# EasyEDA Pro project ProPrj_KrabbyUno - v0.1_2026-05-19.epro, schematic Schematic2

## Sheets
1 P1: Board Name: Schematic2; Create Date: 2026-01-31; Page Name: P1; Project Name: Patina Foundation Grant; Schematic Name: Schematic2; Update Date: 2026-04-19; Company: EasyEDA.com; Page Size: A4; Version: V1.0
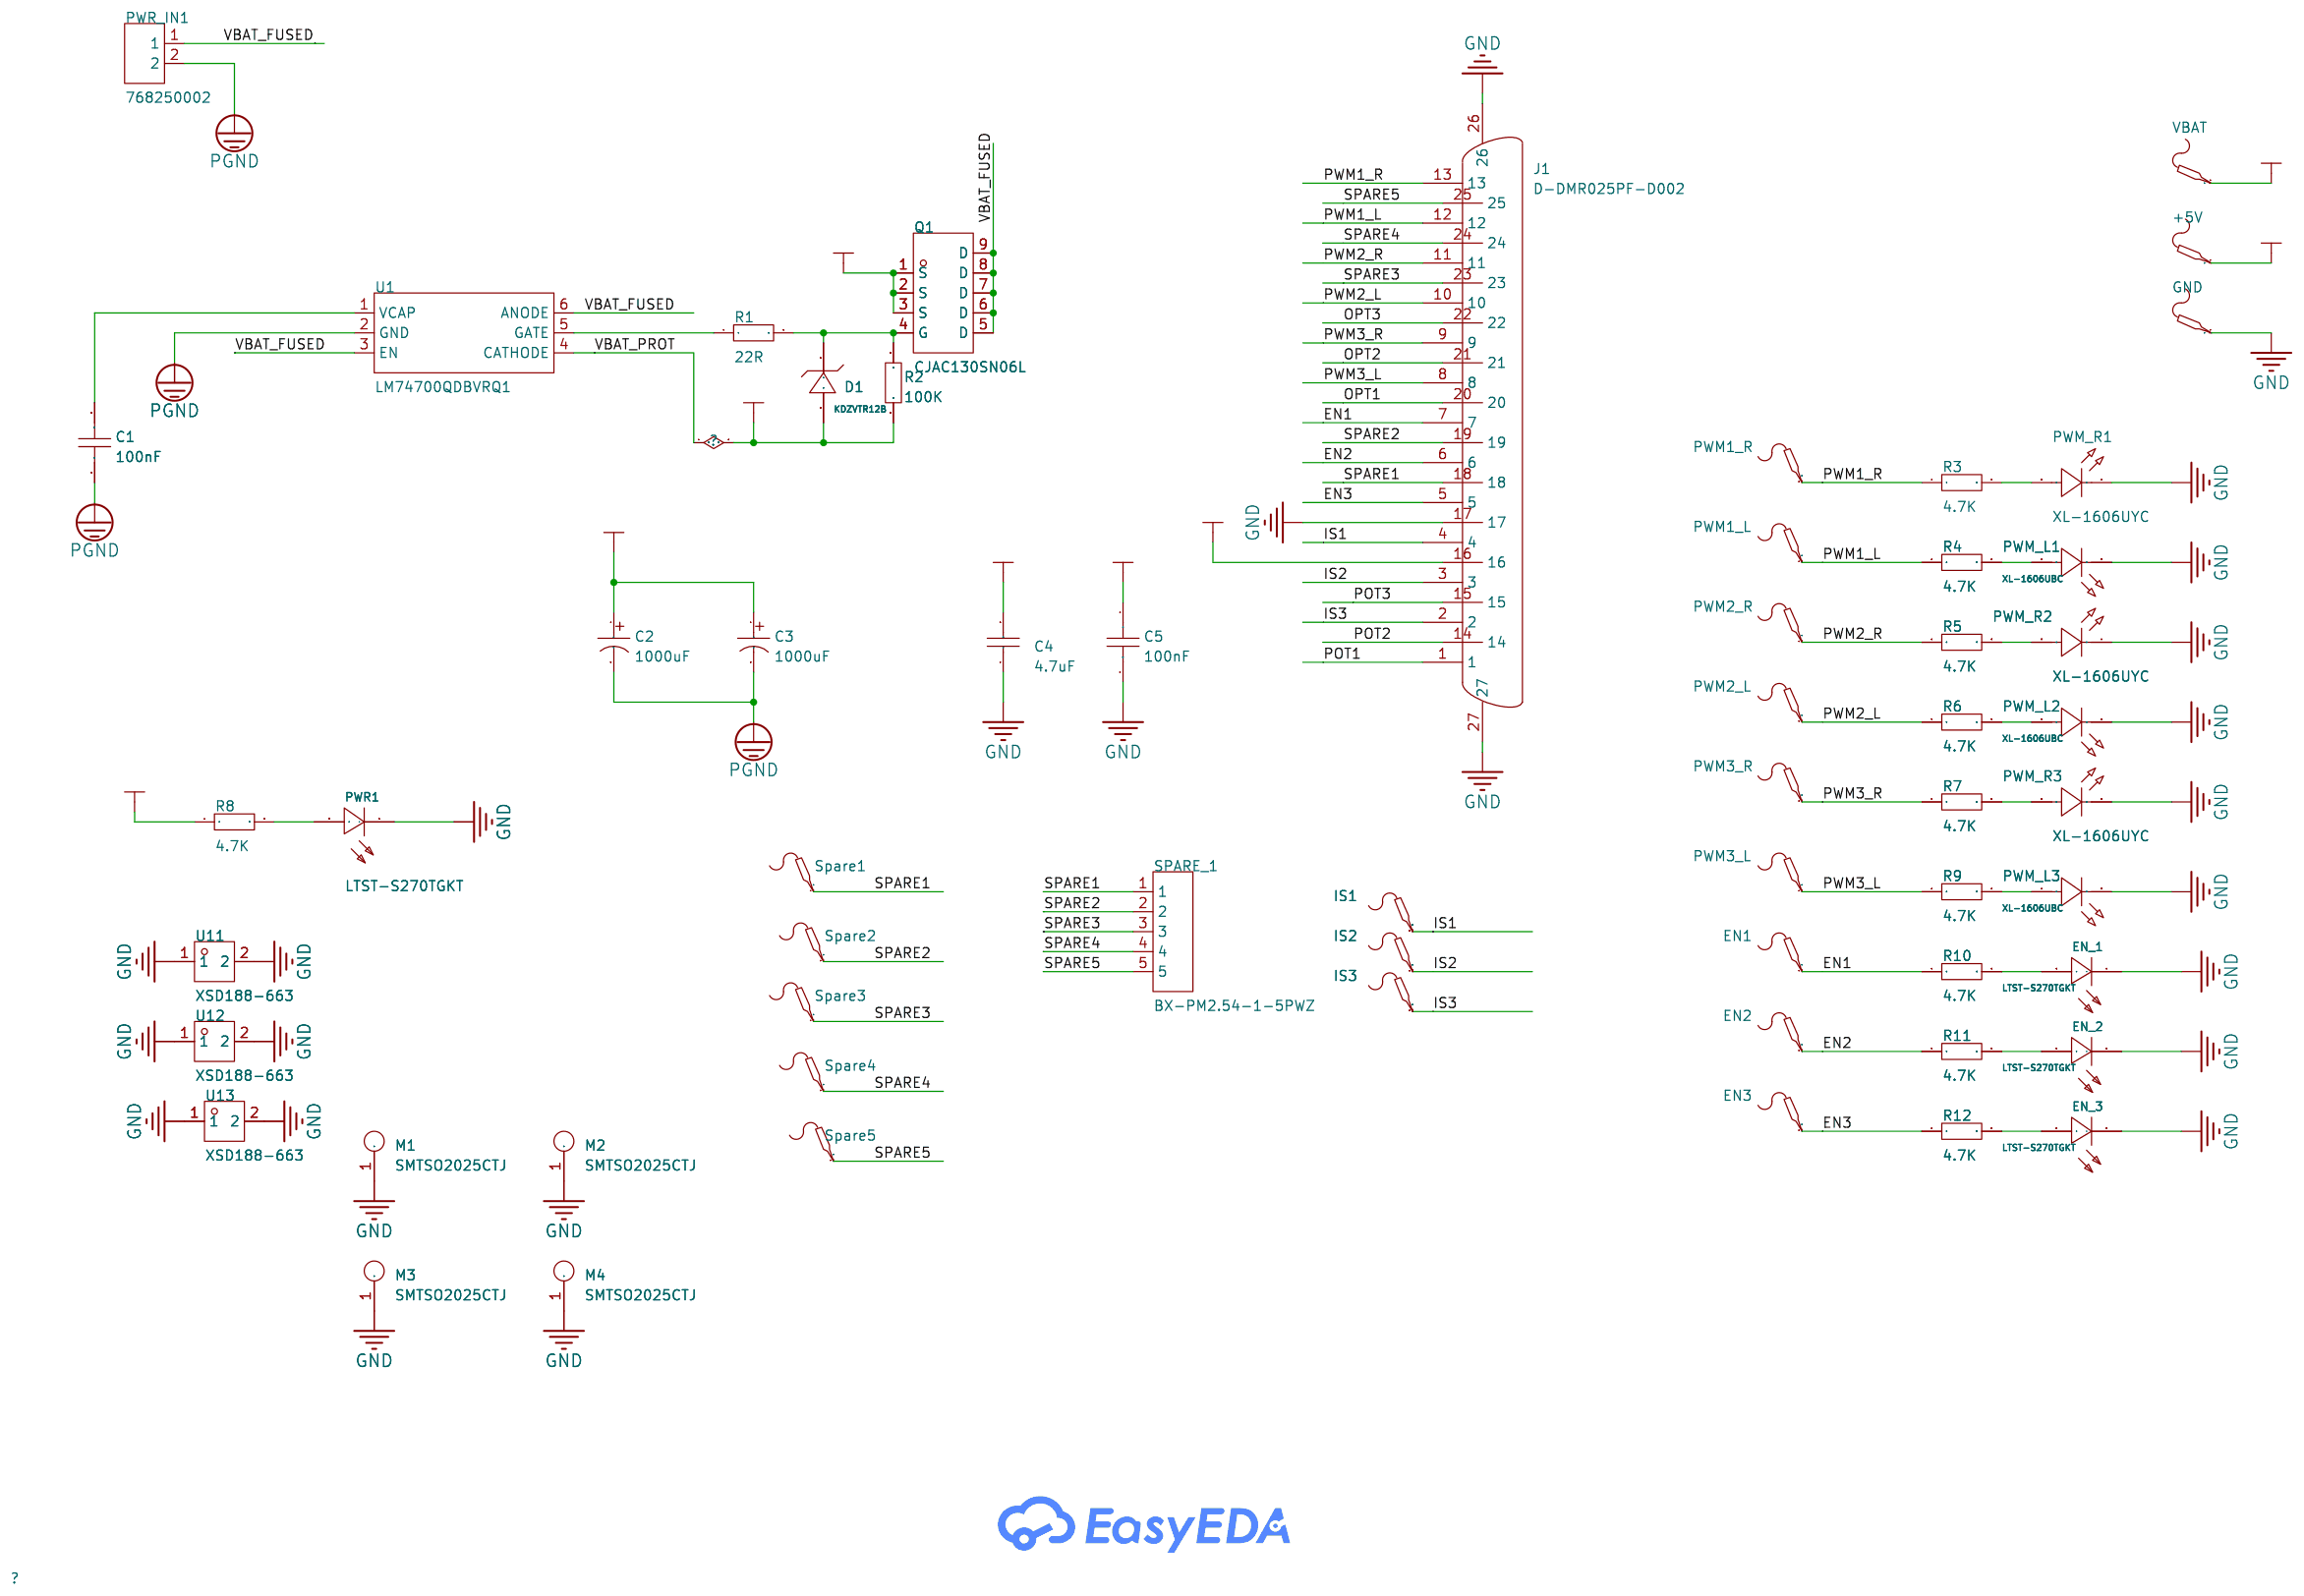
[diagram p2: P1]
2 Motor 1: Create Date: 2026-02-01; Page Name: Motor 1
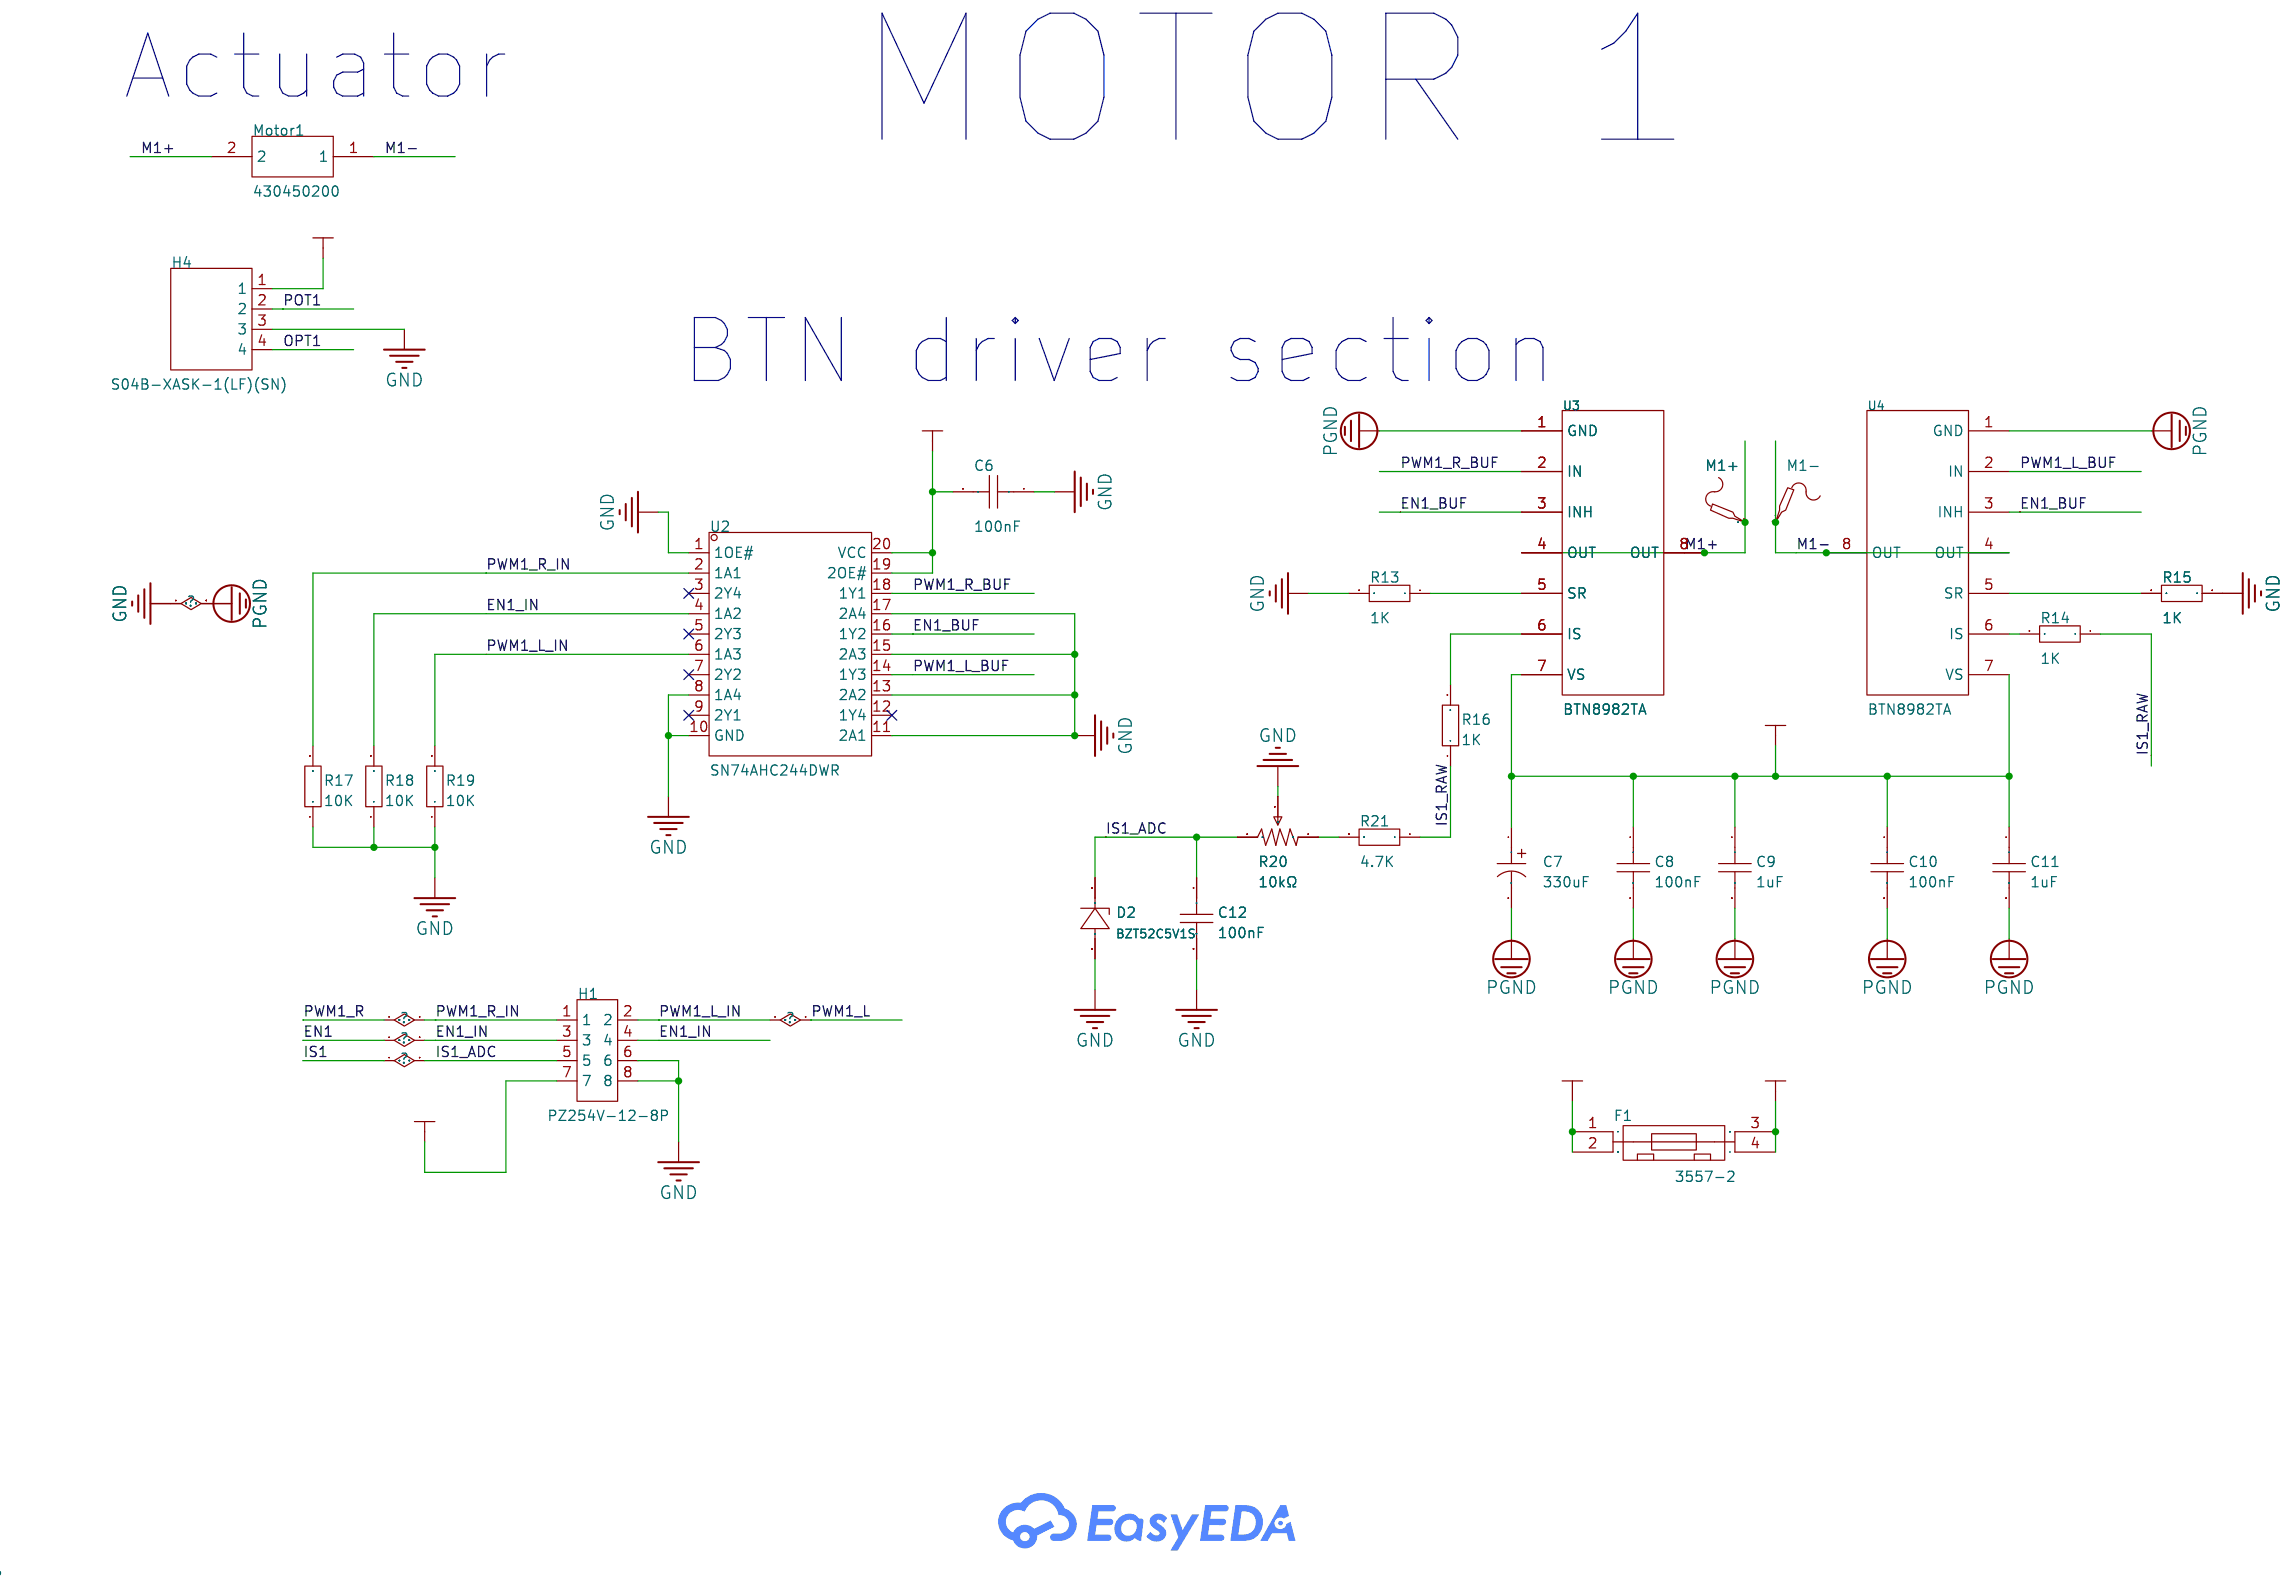
[diagram p3: Motor 1]
3 Motor 2: Create Date: 2026-02-02; Page Name: Motor 2
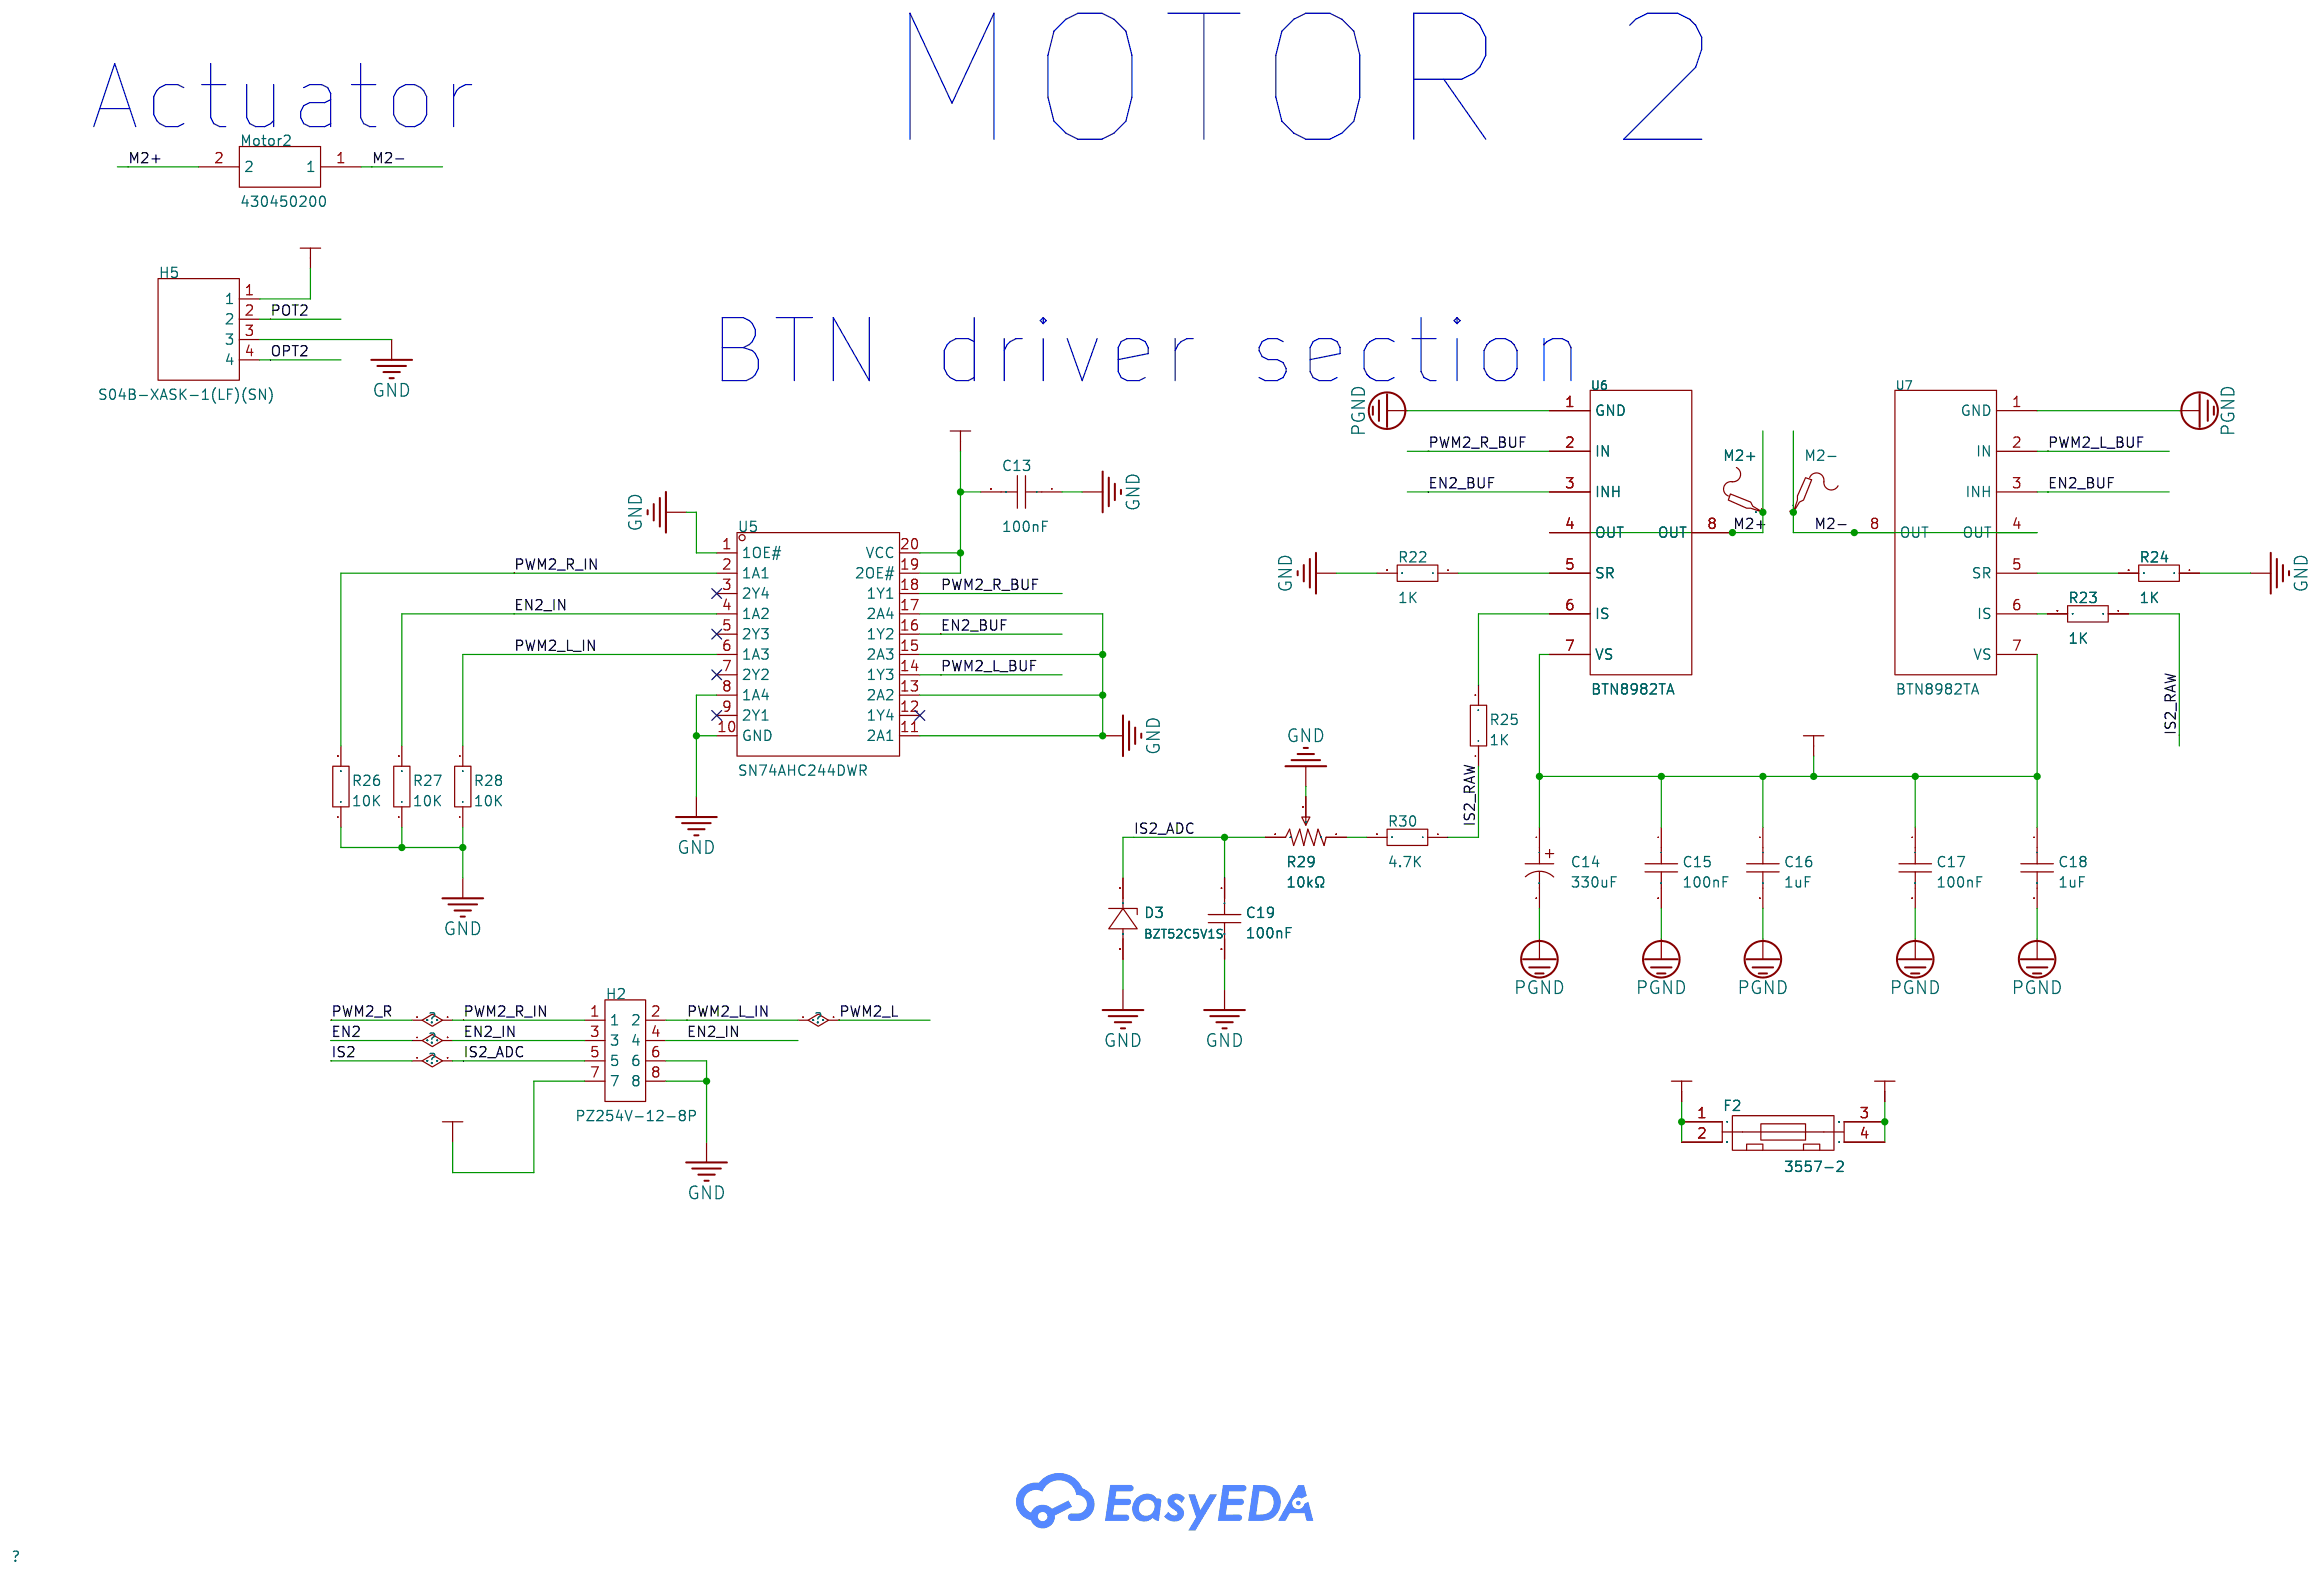
[diagram p4: Motor 2]
4 Motor 3: Create Date: 2026-02-02; Page Name: Motor 3
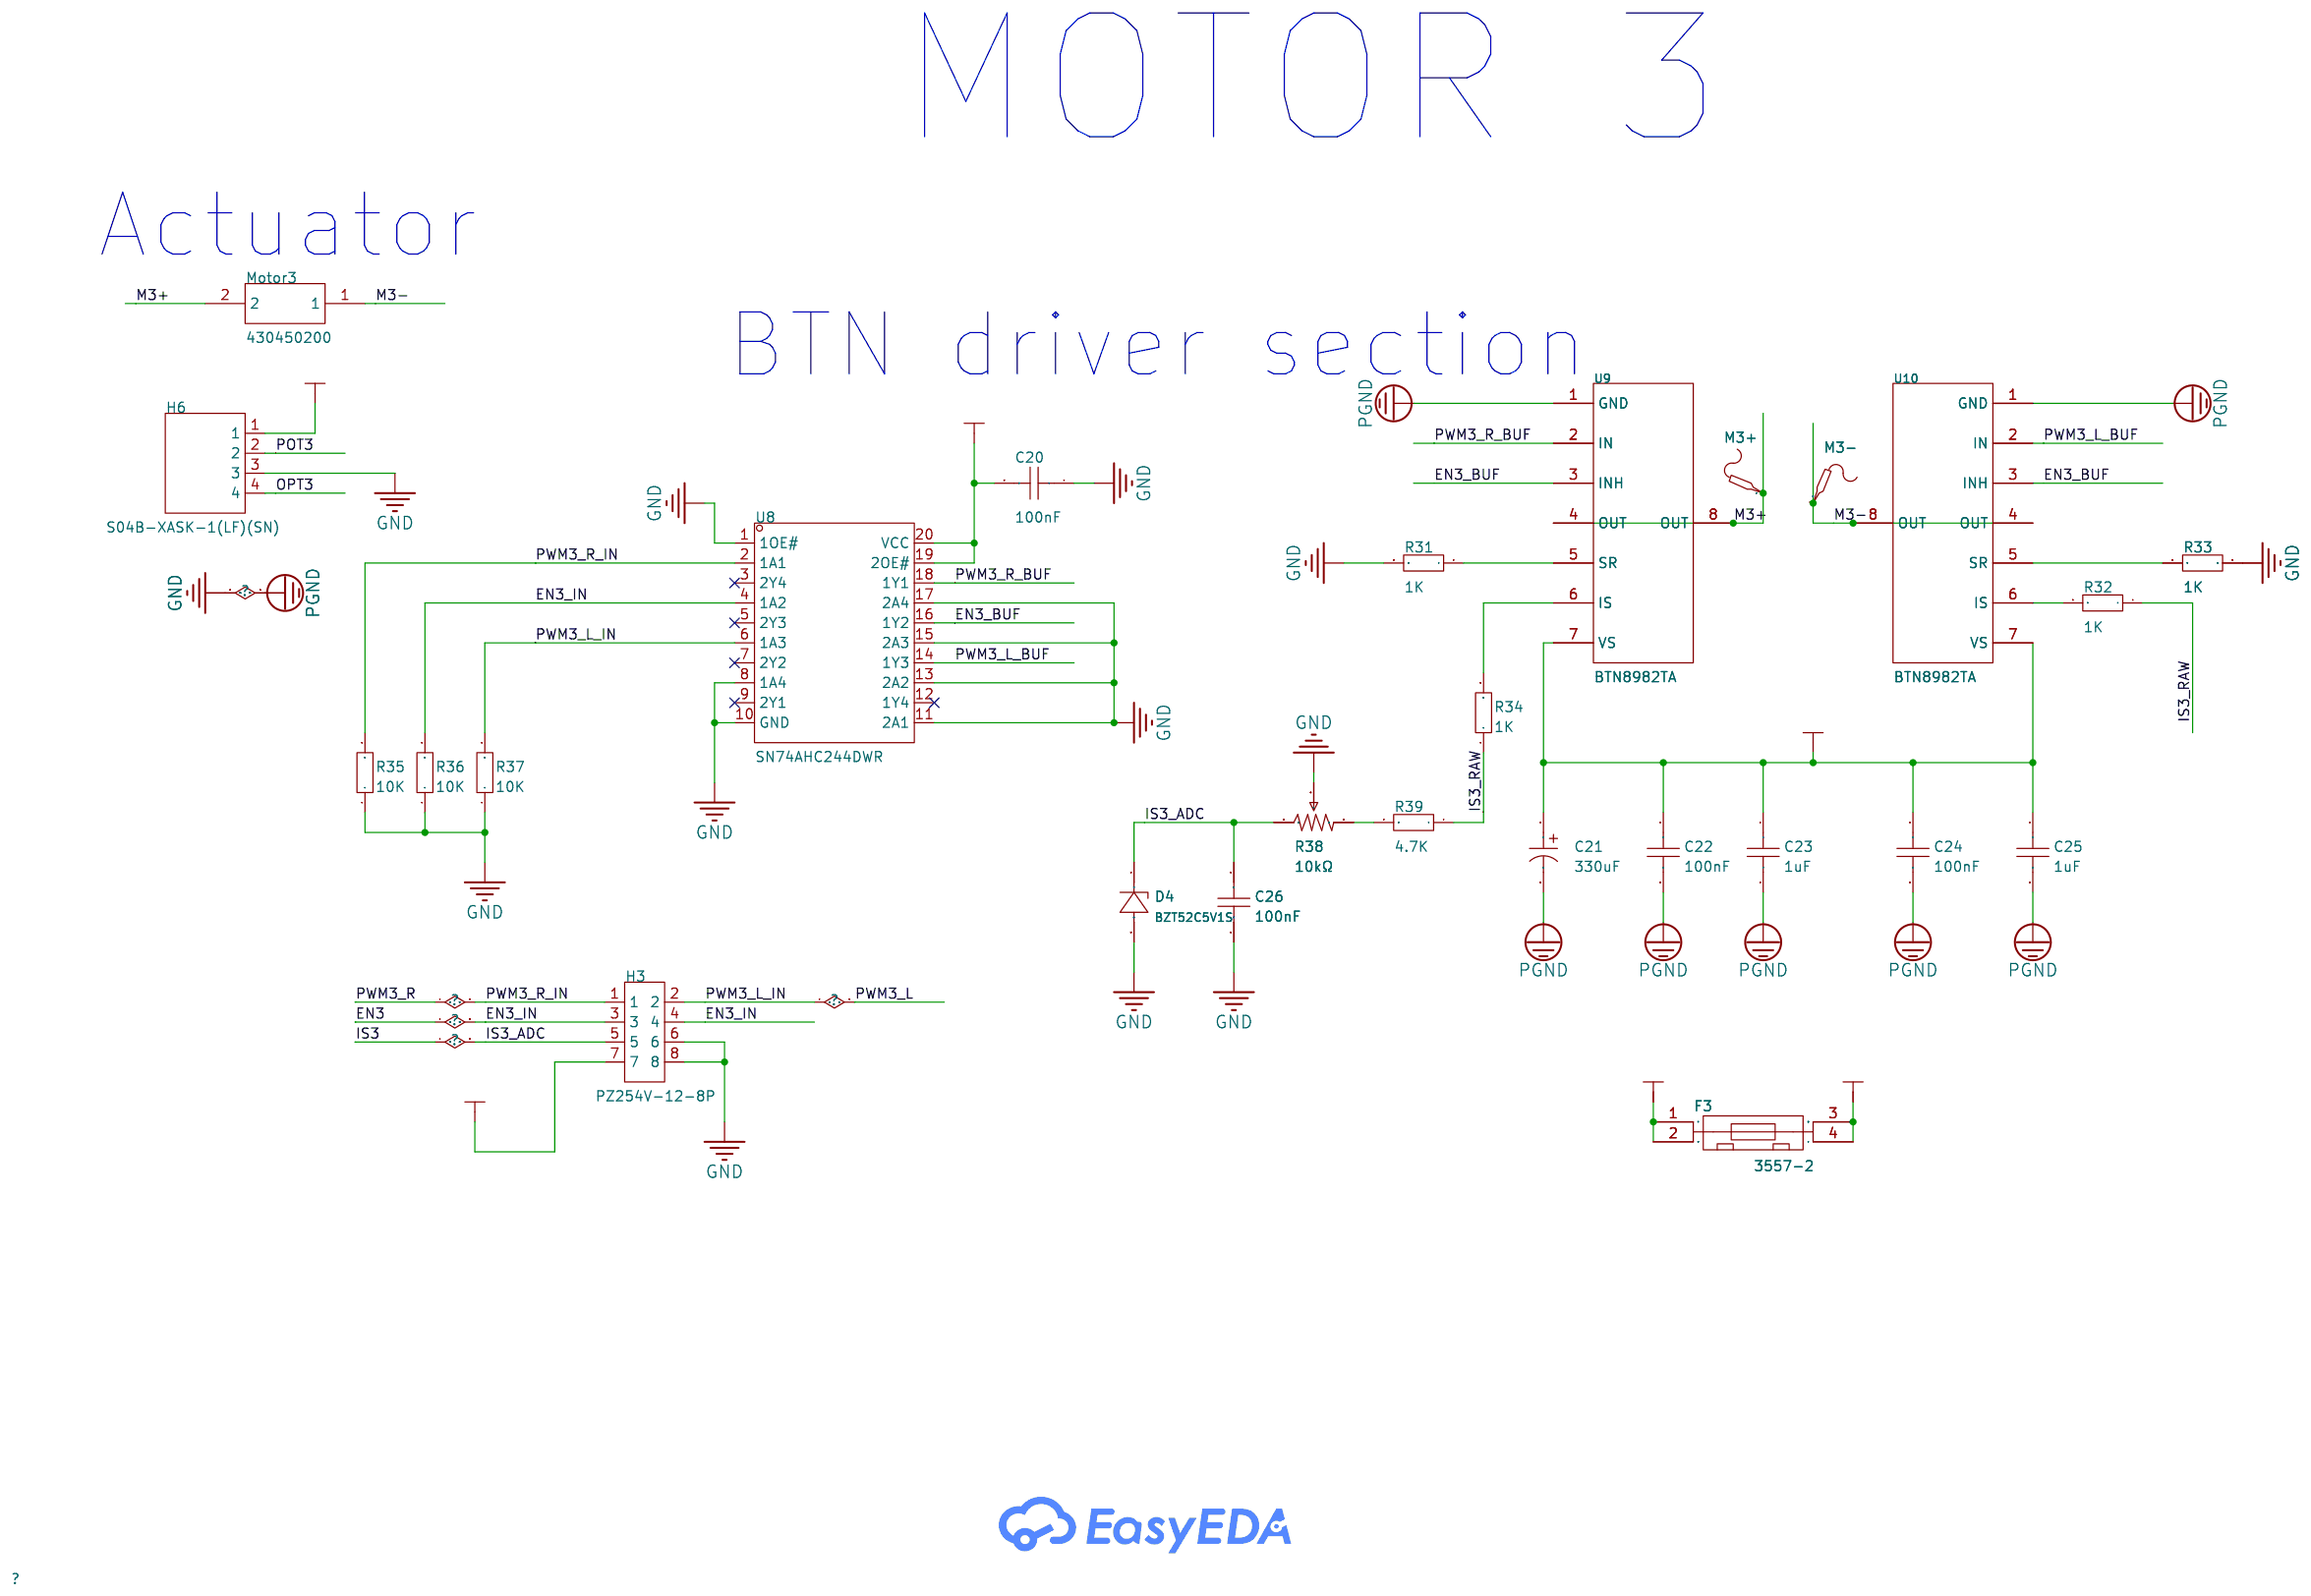
[diagram p5: Motor 3]

## Parts
sheet Motor 1
C6  100nF  [C0603]
C7  330uF  [CAP-SMD_BD10.0-L10.3-W10.3-LS11.0-FD]
C8  100nF  [C0603]
C9  1uF  [C0603]
C10  100nF  [C0603]
C11  1uF  [C0603]
C12  100nF  [C0603]
D2  BZT52C5V1S  [SOD-323_L1.7-W1.3-LS2.5-RD-1]
F1  3557-2  [FUSE-TH_4P-L19.8-W6.7_3557-2]
H1  PZ254V-12-8P  [HDR-TH_8P-P2.54-V-M-R2-C4-S2.54]
H4  S04B-XASK-1(LF)(SN)  [CONN-TH_S04B-XASK-1-LF-SN]
M1+  -  [Test-Point-0.5mm]
M1-  -  [Test-Point-0.5mm]
Motor1  430450200  [CONN-TH_43045-0200]
R13  1K  [R0603]
R14  1K  [R0603]
R15  1K  [R0603]
R16  1K  [R0603]
R17  10K  [R0603]
R18  10K  [R0603]
R19  10K  [R0603]
R20  10kΩ  [RES-ADJ-SMD_3P-L3.0-W3.8-P1.75-BR]
R21  4.7K  [R0603]
U2  SN74AHC244DWR  [SOIC-20_L13.0-W7.6-P1.27-LS10.3-BL]
U3  BTN8982TA  [TO-263-7_L10.2-W10.4-P1.27-LS14.4-TL]
U4  BTN8982TA  [TO-263-7_L10.2-W10.4-P1.27-LS14.4-TL]
sheet Motor 2
C13  100nF  [C0603]
C14  330uF  [CAP-SMD_BD10.0-L10.3-W10.3-LS11.0-FD]
C15  100nF  [C0603]
C16  1uF  [C0603]
C17  100nF  [C0603]
C18  1uF  [C0603]
C19  100nF  [C0603]
D3  BZT52C5V1S  [SOD-323_L1.7-W1.3-LS2.5-RD-1]
F2  3557-2  [FUSE-TH_4P-L19.8-W6.7_3557-2]
H2  PZ254V-12-8P  [HDR-TH_8P-P2.54-V-M-R2-C4-S2.54]
H5  S04B-XASK-1(LF)(SN)  [CONN-TH_S04B-XASK-1-LF-SN]
M2+  -  [Test-Point-0.5mm]
M2-  -  [Test-Point-0.5mm]
Motor2  430450200  [CONN-TH_43045-0200]
R22  1K  [R0603]
R23  1K  [R0603]
R24  1K  [R0603]
R25  1K  [R0603]
R26  10K  [R0603]
R27  10K  [R0603]
R28  10K  [R0603]
R29  10kΩ  [RES-ADJ-SMD_3P-L3.0-W3.8-P1.75-BR]
R30  4.7K  [R0603]
U5  SN74AHC244DWR  [SOIC-20_L13.0-W7.6-P1.27-LS10.3-BL]
U6  BTN8982TA  [TO-263-7_L10.2-W10.4-P1.27-LS14.4-TL]
U7  BTN8982TA  [TO-263-7_L10.2-W10.4-P1.27-LS14.4-TL]
sheet Motor 3
C20  100nF  [C0603]
C21  330uF  [CAP-SMD_BD10.0-L10.3-W10.3-LS11.0-FD]
C22  100nF  [C0603]
C23  1uF  [C0603]
C24  100nF  [C0603]
C25  1uF  [C0603]
C26  100nF  [C0603]
D4  BZT52C5V1S  [SOD-323_L1.7-W1.3-LS2.5-RD-1]
F3  3557-2  [FUSE-TH_4P-L19.8-W6.7_3557-2]
H3  PZ254V-12-8P  [HDR-TH_8P-P2.54-V-M-R2-C4-S2.54]
H6  S04B-XASK-1(LF)(SN)  [CONN-TH_S04B-XASK-1-LF-SN]
M3+  -  [Test-Point-0.5mm]
M3-  -  [Test-Point-0.5mm]
Motor3  430450200  [CONN-TH_43045-0200]
R31  1K  [R0603]
R32  1K  [R0603]
R33  1K  [R0603]
R34  1K  [R0603]
R35  10K  [R0603]
R36  10K  [R0603]
R37  10K  [R0603]
R38  10kΩ  [RES-ADJ-SMD_3P-L3.0-W3.8-P1.75-BR]
R39  4.7K  [R0603]
U8  SN74AHC244DWR  [SOIC-20_L13.0-W7.6-P1.27-LS10.3-BL]
U9  BTN8982TA  [TO-263-7_L10.2-W10.4-P1.27-LS14.4-TL]
U10  BTN8982TA  [TO-263-7_L10.2-W10.4-P1.27-LS14.4-TL]
sheet P1
+5V  -  [Test-Point-0.5mm]
C1  100nF  [C0603]
C2  1000uF  [CAP-TH_BD12.5-P5.00-D0.6-FD]
C3  1000uF  [CAP-TH_BD12.5-P5.00-D0.6-FD]
C4  4.7uF  [C0805]
C5  100nF  [C0603]
D1  KDZVTR12B  [SOD-123FL_L2.7-W1.8-LS3.8-RD]
EN1  -  [Test-Point-0.5mm]
EN2  -  [Test-Point-0.5mm]
EN3  -  [Test-Point-0.5mm]
EN_1  LTST-S270TGKT  [LED-SMD_L1.7-W0.6-RD_GREEN]
EN_2  LTST-S270TGKT  [LED-SMD_L1.7-W0.6-RD_GREEN]
EN_3  LTST-S270TGKT  [LED-SMD_L1.7-W0.6-RD_GREEN]
GND  -  [Test-Point-0.5mm]
IS1  -  [Test-Point-0.5mm]
IS2  -  [Test-Point-0.5mm]
IS3  -  [Test-Point-0.5mm]
J1  D-DMR025PF-D002  [DB25-TH_D-DMR025PF-D002]
M1  SMTSO2025CTJ  [SMD-1_BD6.2-D3.6]  (no BOM)
M2  SMTSO2025CTJ  [SMD-1_BD6.2-D3.6]  (no BOM)
M3  SMTSO2025CTJ  [SMD-1_BD6.2-D3.6]  (no BOM)
M4  SMTSO2025CTJ  [SMD-1_BD6.2-D3.6]  (no BOM)
PWM1_L  -  [Test-Point-0.5mm]
PWM1_R  -  [Test-Point-0.5mm]
PWM2_L  -  [Test-Point-0.5mm]
PWM2_R  -  [Test-Point-0.5mm]
PWM3_L  -  [Test-Point-0.5mm]
PWM3_R  -  [Test-Point-0.5mm]
PWM_L1  XL-1606UBC  [LED-SMD_L1.7-W1.1-R-RD_BULE]
PWM_L2  XL-1606UBC  [LED-SMD_L1.7-W1.1-R-RD_BULE]
PWM_L3  XL-1606UBC  [LED-SMD_L1.7-W1.1-R-RD_BULE]
PWM_R1  XL-1606UYC  [LED-SMD_L1.7-W1.1-RD_27-21]
PWM_R2  XL-1606UYC  [LED-SMD_L1.7-W1.1-RD_27-21]
PWM_R3  XL-1606UYC  [LED-SMD_L1.7-W1.1-RD_27-21]
PWR1  LTST-S270TGKT  [LED-SMD_L1.7-W0.6-RD_GREEN]
PWR_IN1  768250002  [CONN-TH_768250002]
Q1  CJAC130SN06L  [PDFN-8_L5.8-W5.0-P1.27-LS6.0-BL]
R1  22R  [R0603]
R2  100K  [R0603]
R3  4.7K  [R0603]
R4  4.7K  [R0603]
R5  4.7K  [R0603]
R6  4.7K  [R0603]
R7  4.7K  [R0603]
R8  4.7K  [R0603]
R9  4.7K  [R0603]
R10  4.7K  [R0603]
R11  4.7K  [R0603]
R12  4.7K  [R0603]
Spare1  -  [Test-Point-0.5mm]
Spare2  -  [Test-Point-0.5mm]
Spare3  -  [Test-Point-0.5mm]
Spare4  -  [Test-Point-0.5mm]
Spare5  -  [Test-Point-0.5mm]
SPARE_1  BX-PM2.54-1-5PWZ  [HDR-TH_5P-P2.54-H-F-W10.0-N]
U1  LM74700QDBVRQ1  [SOT-23-6_L2.9-W1.6-P0.95-LS2.8-BL]
U11  XSD188-663  [HEATSINK-SMD_XSD188-663]
U12  XSD188-663  [HEATSINK-SMD_XSD188-663]
U13  XSD188-663  [HEATSINK-SMD_XSD188-663]
VBAT  -  [Test-Point-0.5mm]

## Library data of the parts
C5 C6 C8-C13 C15-C20 C22-C26 = CAP_0603: Supplier Footprint: 0603
C7 C14 C21 = RVT1H331M1010 330UF 50V: Capacitance:330uF Tolerance:±20% Tolerance:±20% Voltage Rating:50V Ripple Current:- Equivalent Series Resistance(ESR):- Diameter:10mm Height - Seated (Max):10.2mm Lifetime:2800hrs@105℃ Operating Temperature:-55℃~+105℃ Operating Temperature:-55℃~+105℃; LCSC Part Name: 330uF ±20% 50V; Supplier Part: C2687701; Manufacturer: DMBJ(振宝佳); Supplier Footprint: SMD,D10xL10.2mm; JLCPCB Part Class: Extended Part; Datasheet: https://item.szlcsc.com/datasheet/RVT1H331M1010%2520330UF%252050V/2791856.html; Supplier: LCSC; Tolerance: ±20%; Voltage Rating: 50V; Diameter: 10mm; Height - Seated (Max): 10.2mm; Lifetime: 2800hrs@105℃; Operating Temperature: -55℃~+105℃
D2-D4 = BZT52C5V1S_C22368927: Zener Voltage(Nom):5.1V Reverse Leakage Current (Ir):2uA@2V Zener Voltage(Range):4.8V~5.4V Zener Voltage(Range):4.8V~5.4V Pd - Power Dissipation:200mW Impedance(Zzt):60Ω Impedance(Zzk):480Ω Operating Junction Temperature Range:-55℃~+150℃ Operating Junctio; LCSC Part Name: 耐压:5.1V 电流:2uA@2V; Supplier Part: C22368927; Manufacturer: Wild Goose(威谷); Supplier Footprint: SOD-323; JLCPCB Part Class: Extended Part; Datasheet: https://item.szlcsc.com/datasheet/BZT52C5V1S/23847239.html; Supplier: LCSC; Zener Voltage(Nom): 5.1V; Reverse Leakage Current (Ir): 2uA@2V; Zener Voltage(Range): 4.8V~5.4V; Pd - Power Dissipation: 200mW; Impedance(Zzt): 60Ω; Impedance(Zzk): 480Ω; Operating Junction Temperature Range: -55℃~+150℃
F1-F3 = 3557-2: Fuseholder Type:Bracket type Number of Circuits:1 Voltage Rating:500V Current Rating:30A Fuse Type:Blade; LCSC Part Name: 30A 500V 支座型; Supplier Part: C352820; Manufacturer: Keystone; JLCPCB Part Class: Extended Part; Datasheet: https://item.szlcsc.com/datasheet/3557-2/328627.html; Supplier: LCSC; Fuseholder Type: Bracket type; Number of Circuits: 1; Voltage Rating: 500V; Current Rating: 30A; Fuse Type: Blade
H1-H3 = PZ254V-12-8P: Pin Structure:2x4P Pitch:2.54mm Row Spacing:2.54mm Circluar Pins/Square Pins:Pin Header Mounting Type:Through Hole Number of Rows:2 Number of Pins:8P Current Rating:- Voltage Rating (Max):- Length of Mating Pin:6mm Insulation Height:2.5mm Length of End Co; LCSC Part Name: 2x4P 间距:2.54mm 方针 直插; Supplier Part: C492421; Manufacturer: XFCN(兴飞); Supplier Footprint: 插件,P=2.54mm; JLCPCB Part Class: Extended Part; Datasheet: https://item.szlcsc.com/datasheet/PZ254V-12-8P/502977.html; Supplier: LCSC; Pin Structure: 2x4P; Pitch: 2.54mm; Row Spacing: 2.54mm; Circluar Pins/Square Pins: Pin Header; Mounting Type: Through Hole; Number of Rows: 2; Number of Pins: 8P; Length of Mating Pin: 6mm; Insulation Height: 2.5mm; Length of End Connection Pin: 3mm; Contact Material: Brass; Operating Temperature: -40℃~+105℃; Color: Black
H4-H6 = S04B-XASK-1(LF)(SN): Pins Structure:1x4P Pitch:2.5mm Mounting Type:Right Angle Reference Series:XA Number of Pins:4P Number of Rows:1 Number of PINs Per Row:4 Row Spacing:- Current Rating:3A Contact Material:Copper Alloy Contact Plating:Tin Operating Temperature:-25℃~+85℃ Ope; LCSC Part Name: 1x4P 间距:2.5mm 弯插 系列:XA; Supplier Part: C265097; Manufacturer: JST; Supplier Footprint: 弯插,P=2.5mm; JLCPCB Part Class: Extended Part; Datasheet: https://item.szlcsc.com/datasheet/S04B-XASK-1(LF)(SN)/255468.html; Supplier: LCSC; Pins Structure: 1x4P; Pitch: 2.5mm; Mounting Type: Right Angle; Reference Series: XA; Number of Pins: 4P; Number of Rows: 1; Number of PINs Per Row: 4; Current Rating: 3A; Contact Material: Copper Alloy; Contact Plating: Tin; Operating Temperature: -25℃~+85℃; Voltage Rating: 250V; Plastic Material: Glass-Fiber Reinforced PA66; Flame Retardant Rating: UL94V-0; Supplementary Features: Harpoon Contact (Plastic)；K Pin; Color: White; Z-Height of the Board: 7.6mm; X-Length of Bottom Edge on Board (Spacing Line): 12.5mm; Y-Width of Bottom Edge on Board: 12.6mm
+5V EN1-EN3 GND IS1-IS3 M1+ M1- M2+ M2- M3+ M3- PWM1_L PWM1_R PWM2_L PWM2_R PWM3_L PWM3_R Spare1-Spare5 VBAT = Test-Point: Test Point 测试点
Motor1-Motor3 = 430450200: Pins Structure:2x1P Pitch:3mm Mounting Style:Bend insert Reference Series:Micro-Fit(MX 3.0) Number of Pins:2P Number of Rows:2 Number of PINs Per Row:1 Row Spacing:3mm Current Rating (Max):8.5A Contact Material:Brass Contact Plating:Tin Operating Temperat; LCSC Part Name: 2x1P 间距:3mm 弯插 系列:Micro-Fit(MX 3.0); Supplier Part: C122431; Manufacturer: MOLEX; Supplier Footprint: 弯插,P=3mm; JLCPCB Part Class: Extended Part; Supplier: LCSC; Pins Structure: 2x1P; Pitch: 3mm; Mounting Style: Bend insert; Reference Series: Micro-Fit(MX 3.0); Number of Pins: 2P; Number of Rows: 2; Number of PINs Per Row: 1; Row Spacing: 3mm; Current Rating (Max): 8.5A; Contact Material: Brass; Contact Plating: Tin; Operating Temperature Range: -40℃~+105℃; Rated Voltage (Max): 600V; Flame Retardant Rating: UL94V-0; Supplementary Features: Fishhook Foot (Plastic); Colour: Black; Z-Height of the Board: 8.77mm; X-Length of Bottom Edge on Board (Spacing Line): 6.65mm; Y-Width of Bottom Edge on Board: 12.24mm
R1-R19 R21-R28 R30-R37 R39 = Res_0603: Supplier Footprint: 0603
R20 R29 R38 = TC33X-2-103E: Resistance:10kΩ Tolerance:±25% Tolerance:±25% Voltage Rating:- Power(Watts):150mW Temperature Coefficient:±250ppm/℃ Temperature Coefficient:±250ppm/℃ Number of Turns:; LCSC Part Name: 10kΩ ±25%; Supplier Part: C719176; Manufacturer: BOURNS; Supplier Footprint: SMD-3P,3.8x3.6mm; JLCPCB Part Class: Extended Part; Datasheet: https://item.szlcsc.com/datasheet/TC33X-2-103E/762158.html; Supplier: LCSC; Tolerance: ±25%; Power(Watts): 150mW; Temperature Coefficient: ±250ppm/℃
U2 U5 U8 = SN74AHC244DWR: Operating Temperature:-40℃~+85℃ Operating Temperature:-40℃~+85℃; Supplier Part: C7473; Manufacturer: TI(德州仪器); Supplier Footprint: SOIC-20-300mil; JLCPCB Part Class: Extended Part; Datasheet: https://www.ti.com/cn/lit/gpn/sn74ahc244; Supplier: LCSC; Operating Temperature: -40℃~+85℃
U3 U4 U6 U7 U9 U10 = BTN8982TA: Supplier Part: C74175; Manufacturer: Infineon(英飞凌); Supplier Footprint: TO-263-7; JLCPCB Part Class: Extended Part; Datasheet: https://item.szlcsc.com/datasheet/BTN8982TA/75294.html; Supplier: LCSC
C1 = CC0603KRX7R9BB104: Capacitance:100nF Tolerance:±10% Tolerance:±10% Voltage Rating:50V Temperature Coefficient:X7R; LCSC Part Name: 100nF ±10% 50V; Supplier Part: C14663; Manufacturer: YAGEO(国巨); Supplier Footprint: 0603; JLCPCB Part Class: Basic Part; Datasheet: https://item.szlcsc.com/datasheet/CC0603KRX7R9BB104/15331.html; Supplier: LCSC; Tolerance: ±10%; Voltage Rating: 50V; Temperature Coefficient: X7R
C2 C3 = KM108M035J20RR0VH2FP0: Capacitance:1000uF Tolerance:±20% Tolerance:±20% Voltage Rating:35V Ripple Current:- Equivalent Series Resistance(ESR):- Pin Spacing:5mm Diameter:13mm Height - Seated (Max):20mm Lifetime:2000hrs@105℃; LCSC Part Name: 1000uF ±20% 35V; Supplier Part: C10749; Manufacturer: Chengx(承兴); Supplier Footprint: 插件,D13xL20mm; JLCPCB Part Class: Extended Part; Datasheet: https://item.szlcsc.com/datasheet/KM108M035J20RR0VH2FP0/11293.html; Supplier: LCSC; Tolerance: ±20%; Voltage Rating: 35V; Pin Spacing: 5mm; Diameter: 13mm; Height - Seated (Max): 20mm; Lifetime: 2000hrs@105℃
C4 = CL21A475KBQNNNE: Capacitance:4.7uF Tolerance:±10% Tolerance:±10% Voltage Rating:50V Temperature Coefficient:X5R; LCSC Part Name: 4.7uF ±10% 50V; Supplier Part: C98192; Manufacturer: SAMSUNG(三星); Supplier Footprint: 0805; JLCPCB Part Class: Extended Part; Datasheet: https://item.szlcsc.com/datasheet/CL21A475KBQNNNE/99401.html; Supplier: LCSC; Tolerance: ±10%; Voltage Rating: 50V; Temperature Coefficient: X5R
D1 = KDZVTR12B: Diode Configuration:1 Independent Zener Voltage(Nom):12V Reverse Leakage Current (Ir):10uA@9V Zener Voltage(Range):12V~13.5V Zener Voltage(Range):12V~13.5V Pd - Power Dissipation:1W Impedance(Zzt):- Impedance(Zzk):- Operating Junction Temperature Range:-; LCSC Part Name: 独立式 耐压:12V 电流:10uA@9V; Supplier Part: C209599; Manufacturer: ROHM(罗姆); Supplier Footprint: SOD-123FL; JLCPCB Part Class: Extended Part; Datasheet: https://item.szlcsc.com/datasheet/KDZVTR12B/210588.html; Supplier: LCSC; Diode Configuration: 1 Independent; Zener Voltage(Nom): 12V; Reverse Leakage Current (Ir): 10uA@9V; Zener Voltage(Range): 12V~13.5V; Pd - Power Dissipation: 1W
EN_1-EN_3 PWR1 = LTST-S270TGKT: Illumination Color:Yellow Green Voltage - Forward(Vf):3.2V Voltage - Forward(Vf):3.2V Power(Watts):76mW Forward Current:20mA Wavelength - Dominant:525nm Wavelength - Dominant:525nm Peak Wavelength:530nm Diode Configuration:- Lens Color:Water Clear Color T; LCSC Part Name: 普绿/黄绿 侧贴; Supplier Part: C364567; Manufacturer: LITEON(光宝); Supplier Footprint: SMD,1.2x1.6mm; JLCPCB Part Class: Extended Part; Datasheet: https://item.szlcsc.com/datasheet/LTST-S270TGKT/338897.html; Supplier: LCSC; Illumination Color: Yellow Green; Voltage - Forward(Vf): 3.2V; Power(Watts): 76mW; Forward Current: 20mA; Wavelength - Dominant: 525nm; Peak Wavelength: 530nm; Lens Color: Water Clear; Luminous Intensity: 450mcd; Viewing Angle: 130°; Mounting Style: Side View Mount; Operating Temperature: -20℃~+80℃
J1 = D-DMR025PF-D002: Connector Type:Standard D-Sub Gender:Female Number of Pins:25P Mounting Type:Right Angle Number of Rows:2 Current Rating-Signal:3A Current Rating-Power:- Voltage Rating:- Color:Black Operating Temperature:-50℃~+105℃ Operating Temperature:-50℃~+105℃; LCSC Part Name: D-Sub 母 P数:25P; Supplier Part: C190083; Manufacturer: Ckmtw(灿科盟); Supplier Footprint: 弯插; JLCPCB Part Class: Extended Part; Datasheet: https://item.szlcsc.com/datasheet/D-DMR025PF-D002/208465.html; Supplier: LCSC; Connector Type: Standard D-Sub; Gender: Female; Number of Pins: 25P; Mounting Type: Right Angle; Number of Rows: 2; Current Rating-Signal: 3A; Color: Black; Operating Temperature: -50℃~+105℃
M1-M4 = SMTSO2025CTJ: specifications:M2X2.5 surface treatment:镀锡 Product Description:- material quality:-; LCSC Part Name: 雄和远景，电路板表贴圆螺母柱，M2X2.5，铜镀锡,1个; Supplier Part: C2916321; Manufacturer: Sinhoo(雄和远景); JLCPCB Part Class: Extended Part; Datasheet: https://atta.szlcsc.com/upload/public/pdf/source/20211122/17CF5E24EB4D4DC090A80DE3D7DE5E21.pdf; Supplier: LCSC; specifications: M2X2.5; surface treatment: 镀锡
PWM_L1-PWM_L3 = XL-1606UBC: Illumination Color:Blue Voltage - Forward(Vf):2.4V Voltage - Forward(Vf):2.4V Power(Watts):70mW Forward Current:20mA Wavelength - Dominant:460nm~475nm Wavelength - Dominant:460nm~475nm Peak Wavelength:465nm Lens Color:Water Clear Color Temperature:- Color; LCSC Part Name: 0602蓝色贴片式发光二极管; Supplier Part: C965865; Manufacturer: XINGLIGHT(成兴光); Supplier Footprint: SMD,1.7x1.1mm; JLCPCB Part Class: Extended Part; Datasheet: https://item.szlcsc.com/datasheet/XL-1606UBC/1051474.html; Supplier: LCSC; Illumination Color: Blue; Voltage - Forward(Vf): 2.4V; Power(Watts): 70mW; Forward Current: 20mA; Wavelength - Dominant: 460nm~475nm; Peak Wavelength: 465nm; Lens Color: Water Clear; Luminous Intensity: 260mcd; Viewing Angle: 120°; Mounting Style: Side View Mount
PWM_R1-PWM_R3 = XL-1606UYC: Illumination Color:Yellow Voltage - Forward(Vf):2.4V Voltage - Forward(Vf):2.4V Power(Watts):50mW Forward Current:20mA Wavelength - Dominant:585nm~595nm Wavelength - Dominant:585nm~595nm Peak Wavelength:588nm Lens Color:Water Clear Color Temperature:- Col; LCSC Part Name: 0602黄色贴片式发光二极管; Supplier Part: C965862; Manufacturer: XINGLIGHT(成兴光); Supplier Footprint: SMD,1.7x1.1mm; JLCPCB Part Class: Extended Part; Datasheet: https://item.szlcsc.com/datasheet/XL-1606UYC/1051471.html; Supplier: LCSC; Illumination Color: Yellow; Voltage - Forward(Vf): 2.4V; Power(Watts): 50mW; Forward Current: 20mA; Wavelength - Dominant: 585nm~595nm; Peak Wavelength: 588nm; Lens Color: Water Clear; Luminous Intensity: 800mcd; Viewing Angle: 120°; Mounting Style: Side View Mount
PWR_IN1 = 768250002: Pins Structure:2x1P Pitch:5.7mm Mounting Type:Right Angle Number of Pins:2P Number of Rows:2 Number of PINs Per Row:1 Current Rating:23.5A Contact Material:Copper Alloy Contact Plating:Tin Operating Temperature:-40℃~+105℃ Operating Temperature:-40℃~+105℃; LCSC Part Name: 2x1P 间距:5.7mm 弯插; Supplier Part: C586017; Manufacturer: MOLEX; JLCPCB Part Class: Extended Part; Datasheet: https://www.molex.com/content/dam/molex/molex-dot-com/products/automated/en-us/salesdrawingpdf/768/76825/768250002_sd.pdf?inline\; Supplier: LCSC; Pins Structure: 2x1P; Pitch: 5.7mm; Mounting Type: Right Angle; Number of Pins: 2P; Number of Rows: 2; Number of PINs Per Row: 1; Current Rating: 23.5A; Contact Material: Copper Alloy; Contact Plating: Tin; Operating Temperature: -40℃~+105℃; Voltage Rating: 600V; Flame Retardant Rating: UL94V-0; Color: Black; Y-Width of Bottom Edge on Board: 28.8mm
Q1 = CJAC130SN06L: Type:1 N-channel Drain Source Voltage (Vdss):60V Continuous Drain Current (Id): Drain Source On Resistance (RDS(on)@Vgs,Id):3.5mΩ@4.5V,20A Power Dissipation (Pd): Gate Threshold Voltage (Vgs(th)@Id):1.6V@250uA Total Gate Charge (Qg@Vgs):66.4nC@10V Input C; LCSC Part Name: 1个N沟道 耐压:60V 电流:130A; Supplier Part: C5441189; Manufacturer: CJ(江苏长电/长晶); Supplier Footprint: PDFNWB-8L(5x6); JLCPCB Part Class: Extended Part; Datasheet: https://atta.szlcsc.com/upload/public/pdf/source/20240329/3FE9E06C856010D1A11B4EA6BBECBF6E.pdf; Supplier: LCSC; Type: 1 N-channel; Drain Source Voltage (Vdss): 60V; Drain Source On Resistance (RDS(on)@Vgs,Id): 3.5mΩ@4.5V,20A; Gate Threshold Voltage (Vgs(th)@Id): 1.6V@250uA; Total Gate Charge (Qg@Vgs): 66.4nC@10V; Input Capacitance (Ciss@Vds): 3560pF@30V; Reverse Transfer Capacitance (Crss@Vds): 82pF@30V; Operating Temperature: -55℃~+150℃
SPARE_1 = BX-PM2.54-1-5PWZ: Holes Structure:1x5P Pitch:2.54mm Circular Hole / Square Hole:Square Hole Mounting Type:Right Angle Number of Rows:1 Number of Positions:5P Current Rating:3A Holes Direction:Side Insulation Height:2.5mm Contact Material:Brass Contact Plating:Gold Operatin; LCSC Part Name: 1x5P 间距:2.54mm 弯插; Supplier Part: C49326038; Manufacturer: Bossie(博锡); Supplier Footprint: 插件,P=2.54mm; JLCPCB Part Class: Extended Part; Datasheet: https://item.szlcsc.com/datasheet/BX-PM2.54-1-5PWZ/51801566.html; Supplier: LCSC; Holes Structure: 1x5P; Pitch: 2.54mm; Circular Hole / Square Hole: Square Hole; Mounting Type: Right Angle; Number of Rows: 1; Number of Positions: 5P; Current Rating: 3A; Holes Direction: Side; Insulation Height: 2.5mm; Contact Material: Brass; Contact Plating: Gold; Operating Temperature: -40℃~+105℃; PIN Length: 3.2mm
U1 = LM74700QDBVRQ1_C2941042: LCSC Part Name: 低IQ电池反向保护理想二极管控制器; Supplier Part: C2941042; Manufacturer: TI(德州仪器); Supplier Footprint: SOT-23-6; JLCPCB Part Class: Extended Part; Datasheet: https://www.ti.com/cn/lit/gpn/lm74700-q1; Supplier: LCSC
U11-U13 = XSD188-663: ProductSize:35*35*14MM Colour:Black TextureOfMaterial:6063-T5 aluminum SurfaceTreatment:Black Oxide Shape:- NumberOfHoles:- NumberOfTeeth:- NumberOfNails:- SpringBuckle:- type:- Thermal conductivity:- working temperature:- Flame retardant:- specifications; LCSC Part Name: XSD(鑫顺达)CPU芯片显卡铝型材散热片 35*35*14 黑色开槽双针大功率电子散热器（可定制）; Supplier Part: C286208; Manufacturer: XSD(鑫顺达); JLCPCB Part Class: Extended Part; Datasheet: https://item.szlcsc.com/datasheet/XSD188-663/271483.html; Supplier: LCSC; ProductSize: 35*35*14MM; Colour: Black; TextureOfMaterial: 6063-T5 aluminum; SurfaceTreatment: Black Oxide

## Nets
+5V: +5V.1 C4.2 C5.1 C6.2 C13.2 C20.2 H1.7 H2.7 H3.7 H4.1 H5.1 H6.1 J1.16 R8.1 U2.19(2OE#) U2.20(VCC) U5.19(2OE#) U5.20(VCC) U8.19(2OE#) U8.20(VCC)
GND: C1.1 C2.2 C3.2 C4.1 C5.2 C6.1 C7.2 C8.2 C9.2 C10.2 C11.2 C12.2 C13.1 C14.2 C15.2 C16.2 C17.2 C18.2 C19.2 C20.1 C21.2 C22.2 C23.2 C24.2 C25.2 C26.2 D2.2 D3.2 D4.2 EN_1.1(-) EN_2.1(-) EN_3.1(-) GND.1 H1.6 H1.8 H2.6 H2.8 H3.6 H3.8 H4.3 H5.3 H6.3 J1.17 J1.26 J1.27 M1.1 M2.1 M3.1 M4.1 PWM_L1.2(K) PWM_L2.2(K) PWM_L3.2(K) PWM_R1.1(K) PWM_R2.1(K) PWM_R3.1(K) PWR1.1(-) PWR_IN1.2 R13.2 R15.1 R17.1 R18.1 R19.1 R20.2 R22.2 R24.1 R26.1 R27.1 R28.1 R29.2 R31.2 R33.1 R35.1 R36.1 R37.1 R38.2 U1.2(GND) U2.1(1OE#) U2.8(1A4) U2.10(GND) U2.11(2A1) U2.13(2A2) U2.15(2A3) U2.17(2A4) U3.1(GND) U4.1(GND) U5.1(1OE#) U5.8(1A4) U5.10(GND) U5.11(2A1) U5.13(2A2) U5.15(2A3) U5.17(2A4) U6.1(GND) U7.1(GND) U8.1(1OE#) U8.8(1A4) U8.10(GND) U8.11(2A1) U8.13(2A2) U8.15(2A3) U8.17(2A4) U9.1(GND) U10.1(GND) U11.1 U11.2 U12.1 U12.2 U13.1 U13.2
VBAT: C2.1 C3.1 D1.2(A) F1.1 F1.2 F2.1 F2.2 F3.1 F3.2 Q1.1(S) Q1.2(S) Q1.3(S) R2.1 U1.4(CATHODE) VBAT.1
VBAT_FUSED: PWR_IN1.1 Q1.5(D) Q1.6(D) Q1.7(D) Q1.8(D) Q1.9(D) U1.3(EN) U1.6(ANODE)
VBAT_M1: C7.1 C8.1 C9.1 C10.1 C11.1 F1.3 F1.4 U3.7(VS) U4.7(VS)
VBAT_M2: C14.1 C15.1 C16.1 C17.1 C18.1 F2.3 F2.4 U6.7(VS) U7.7(VS)
VBAT_M3: C21.1 C22.1 C23.1 C24.1 C25.1 F3.3 F3.4 U9.7(VS) U10.7(VS)
EN1: EN1.1 H1.3 H1.4 J1.7 R10.1 R18.2 U2.4(1A2)
EN1_BUF: U2.16(1Y2) U3.3(INH) U4.3(INH)
EN2: EN2.1 H2.3 H2.4 J1.6 R11.1 R27.2 U5.4(1A2)
EN2_BUF: U5.16(1Y2) U6.3(INH) U7.3(INH)
EN3: EN3.1 H3.3 H3.4 J1.5 R12.1 R36.2 U8.4(1A2)
EN3_BUF: U8.16(1Y2) U9.3(INH) U10.3(INH)
IS1: C12.1 D2.1 H1.5 IS1.1 J1.4 R20.3
IS1_RAW: R14.1 R16.1 R21.1
IS2: C19.1 D3.1 H2.5 IS2.1 J1.3 R29.3
IS2_RAW: R23.1 R25.1 R30.1
IS3: C26.1 D4.1 H3.5 IS3.1 J1.2 R38.3
IS3_RAW: R32.1 R34.1 R39.1
M1+: M1+.1 Motor1.2 U3.4(OUT) U3.8(OUT)
M1-: M1-.1 Motor1.1 U4.4(OUT) U4.8(OUT)
M2+: M2+.1 Motor2.2 U6.4(OUT) U6.8(OUT)
M2-: M2-.1 Motor2.1 U7.4(OUT) U7.8(OUT)
M3+: M3+.1 Motor3.2 U9.4(OUT) U9.8(OUT)
M3-: M3-.1 Motor3.1 U10.4(OUT) U10.8(OUT)
OPT1: H4.4 J1.20
OPT2: H5.4 J1.21
OPT3: H6.4 J1.22
POT1: H4.2 J1.1
POT2: H5.2 J1.14
POT3: H6.2 J1.15
PWM1_L: H1.2 J1.12 PWM1_L.1 R4.1 R19.2 U2.6(1A3)
PWM1_L_BUF: U2.14(1Y3) U4.2(IN)
PWM1_R: H1.1 J1.13 PWM1_R.1 R3.1 R17.2 U2.2(1A1)
PWM1_R_BUF: U2.18(1Y1) U3.2(IN)
PWM2_L: H2.2 J1.10 PWM2_L.1 R6.1 R28.2 U5.6(1A3)
PWM2_L_BUF: U5.14(1Y3) U7.2(IN)
PWM2_R: H2.1 J1.11 PWM2_R.1 R5.1 R26.2 U5.2(1A1)
PWM2_R_BUF: U5.18(1Y1) U6.2(IN)
PWM3_L: H3.2 J1.8 PWM3_L.1 R9.1 R37.2 U8.6(1A3)
PWM3_L_BUF: U8.14(1Y3) U10.2(IN)
PWM3_R: H3.1 J1.9 PWM3_R.1 R7.1 R35.2 U8.2(1A1)
PWM3_R_BUF: U8.18(1Y1) U9.2(IN)
SPARE1: J1.18 Spare1.1 SPARE_1.1
SPARE2: J1.19 Spare2.1 SPARE_1.2
SPARE3: J1.23 Spare3.1 SPARE_1.3
SPARE4: J1.24 Spare4.1 SPARE_1.4
SPARE5: J1.25 Spare5.1 SPARE_1.5
$1N5026: PWM_R1.2(A) R3.2
$1N6475: PWM_L1.1(A) R4.2
$1N6556: PWM_R2.2(A) R5.2
$1N6637: PWM_R3.2(A) R7.2
$1N6809: PWM_L2.1(A) R6.2
$1N6893: PWM_L3.1(A) R9.2
$1N7000: EN_1.2(+) R10.2
$1N7103: EN_2.2(+) R11.2
$1N7182: EN_3.2(+) R12.2
$1N7339: PWR1.2(+) R8.2
$1N7791: C1.2 U1.1(VCAP)
$1N7985: R1.1 U1.5(GATE)
$1N7989: D1.1(K) Q1.4(G) R1.2 R2.2
$2N1023: R13.1 U3.5(SR)
$2N1304: R15.2 U4.5(SR)
$2N2113: R16.2 U3.6(IS)
$2N2143: R14.2 U4.6(IS)
$2N6070: R20.1 R21.2
$3N5041: R22.1 U6.5(SR)
$3N5057: R24.2 U7.5(SR)
$3N5085: R25.2 U6.6(IS)
$3N5086: R23.2 U7.6(IS)
$3N5119: R29.1 R30.2
$4N5103: R31.1 U9.5(SR)
$4N5119: R33.2 U10.5(SR)
$4N5147: R34.2 U9.6(IS)
$4N5148: R32.2 U10.6(IS)
$4N5181: R38.1 R39.2

Not connected (* = marked no-connect by the designer): U2 3(2Y4)* 5(2Y3)* 7(2Y2)* 9(2Y1)* 12(1Y4)*; U5 3(2Y4)* 5(2Y3)* 7(2Y2)* 9(2Y1)* 12(1Y4)*; U8 3(2Y4)* 5(2Y3)* 7(2Y2)* 9(2Y1)* 12(1Y4)*

## Notes on the sheets
sheet 2
- Actuator
- MOTOR 1
- BTN driver section
sheet 3
- Actuator
- MOTOR 2
- BTN driver section
sheet 4
- MOTOR 3
- Actuator
- BTN driver section
